# Altium schematic sheet Power.SchDoc: Power
size A3; Project: STM32L073Z-EVAL; Date: Not used; ApprovedBy: Not used; CheckedBy: Not used; Author: Not used; CompanyName: STMicroelectronics; DrawnBy: Not used; Engineer: Not used; Organization: Not used; Address1: Not used; Address2: Not used; Address3: Not used; Address4: Not used; DocumentNumber: 4; Revision: Not used; SheetNumber: 5; SheetTotal: 13; CurrentTime: Not used; CurrentDate: Not used; Time: Not used; DocumentFullPathAndName: Not used; DocumentName: Not used; ModifiedDate: Not used; ImagePath: Not used; ProjectName: Not used; Application_BuildNumber: Not used
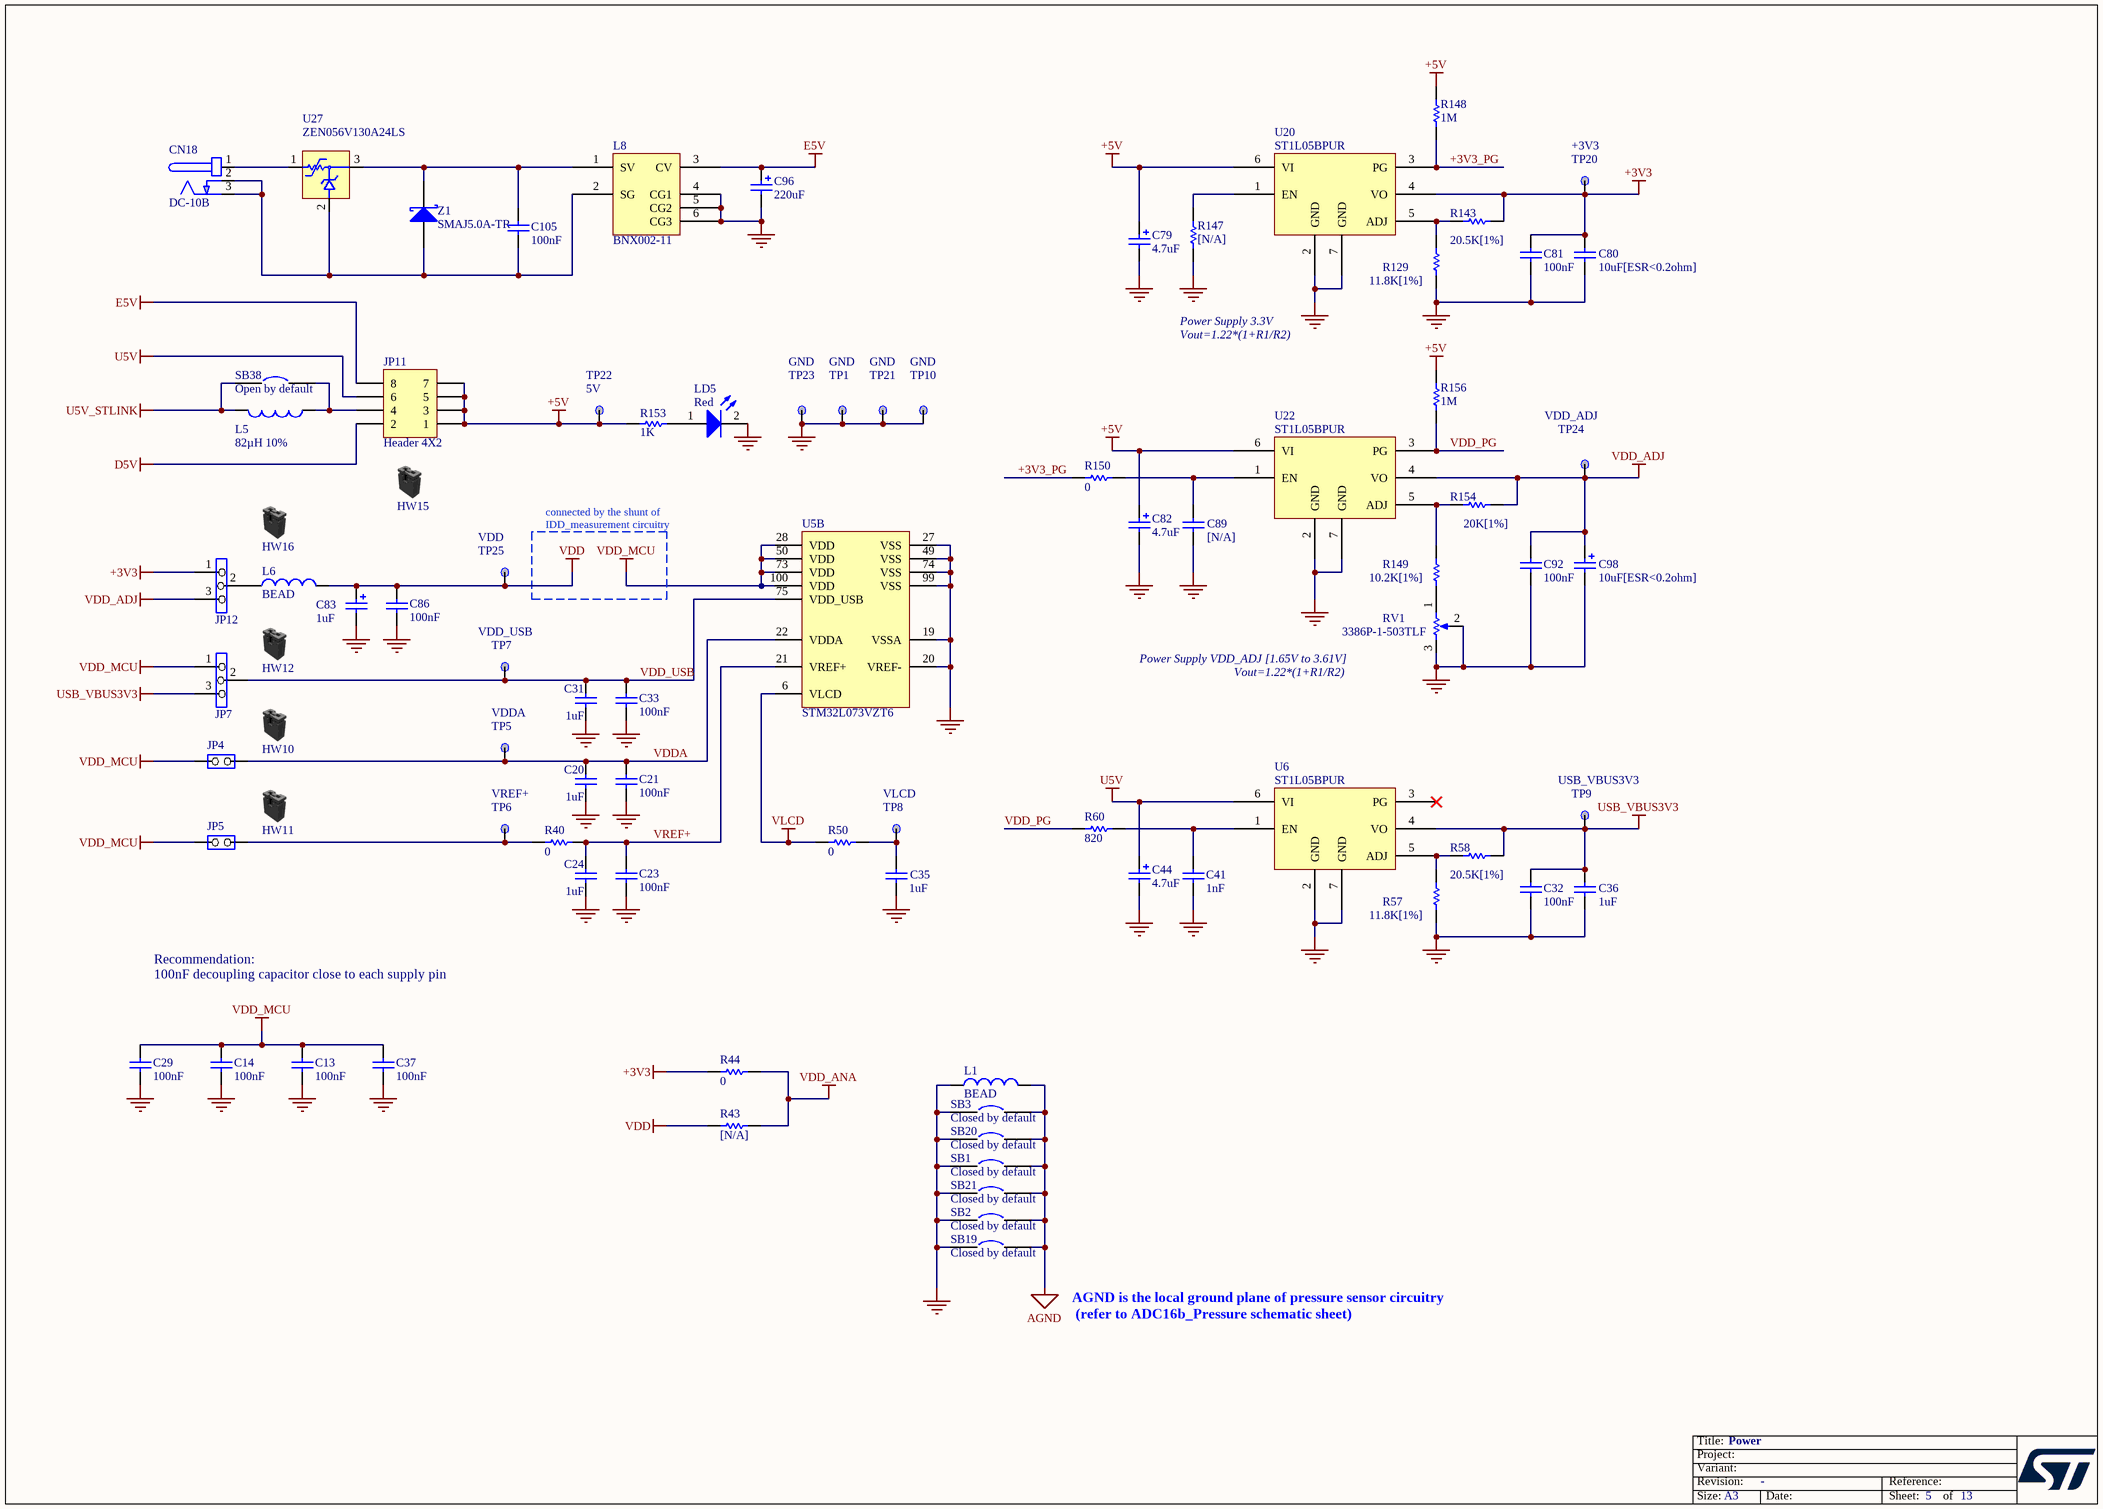
[diagram p0: Power.SchDoc]

## Parts
C13  100nF  [0402C]
C14  100nF  [0402C]
C20  1uF  [0603C]
C21  100nF  [0402C]
C23  100nF  [0402C]
C24  1uF  [0603C]
C29  100nF  [0402C]
C31  1uF  [0603C]
C32  100nF  [0402C]
C33  100nF  [0402C]
C35  1uF  [0603C]
C36  1uF  [0603C]
C37  100nF  [0402C]
C41  1nF  [0603C]
C44  4.7uF  [TAN-A]
C79  4.7uF  [TAN-A]
C80  10uF[ESR<0.2ohm]  [0805C]
C81  100nF  [0402C]
C82  4.7uF  [TAN-A]
C83  1uF  [TAN-A]
C86  100nF  [0402C]
C89  [N/A]  [0603C]
C92  100nF  [0402C]
C96  220uF  [c310m-6]
C98  10uF[ESR<0.2ohm]  [0805C]
C105  100nF  [0402C]
CN18  DC-10B  [PWR_JACK_DC10]
HW10  Shunt Black 2.54mm  (value not drawn)  (mechanical)
HW11  Shunt Black 2.54mm  (value not drawn)  (mechanical)
HW12  Shunt Black 2.54mm  (value not drawn)  (mechanical)
HW15  Shunt Black 2.54mm  (value not drawn)  (mechanical)
HW16  Shunt Black 2.54mm  (value not drawn)  (mechanical)
JP4  (no value)  [SIP2]
JP5  (no value)  [SIP2]
JP7  (no value)  [SIP3]
JP11  Header 4X2  [HDR_2X4_2R54]
JP12  (no value)  [SIP3]
L1  BEAD  [0603L]
L5  82µH 10%  [LSM2_4R9X4R9_H4R1]
L6  BEAD  [0603L]
L8  BNX002-11  [BNX001]
LD5  Red  [0603D]
R40  0  [0603R]
R43  [N/A]  [0603R]
R44  0  [0603R]
R50  0  [0603R]
R57  11.8K[1%]  [0603R]
R58  20.5K[1%]  [0603R]
R60  820  [0603R]
R129  11.8K[1%]  [0603R]
R143  20.5K[1%]  [0603R]
R147  [N/A]  [0603R]
R148  1M  [0603R]
R149  10.2K[1%]  [0603R]
R150  0  [0603R]
R153  1K  [0402R]
R154  20K[1%]  [0603R]
R156  1M  [0603R]
RV1  3386P-1-503TLF  [3386P]
SB1  Closed by default  [SB_0603]
SB2  Closed by default  [SB_0603]
SB3  Closed by default  [SB_0603]
SB19  Closed by default  [SB_0603]
SB20  Closed by default  [SB_0603]
SB21  Closed by default  [SB_0603]
SB38  Open by default  [SB_0603]
TP1  Silkscreen: GND  [TP]  (hidden comment: TP)
TP5  Silkscreen: VDDA  [TP]  (hidden comment: TP)
TP6  Silkscreen: VREF+  [TP]  (hidden comment: TP)
TP7  Silkscreen: VDD_USB  [TP]  (hidden comment: TP)
TP8  Silkscreen: VLCD  [TP]  (hidden comment: TP)
TP9  Silkscreen: USB_VBUS3V3  [TP]  (hidden comment: TP)
TP10  Silkscreen: GND  [TP]  (hidden comment: TP)
TP20  Silkscreen: +3V3  [TP]  (hidden comment: TP)
TP21  Silkscreen: GND  [TP]  (hidden comment: TP)
TP22  Silkscreen: 5V  [TP]  (hidden comment: TP)
TP23  Silkscreen: GND  [TP]  (hidden comment: TP)
TP24  Silkscreen: VDD_ADJ  [TP]  (hidden comment: TP)
TP25  Silkscreen: VDD  [TP]  (hidden comment: TP)
U5  STM32L073VZT6  [IC149_100_025_B5]  (part B of 2)
U6  ST1L05BPUR  [DFN6_0R95_3X3]
U20  ST1L05BPUR  [DFN6_0R95_3X3]
U22  ST1L05BPUR  [DFN6_0R95_3X3]
U27  ZEN056V130A24LS  [TYCO_ZEN056V130A24LS]
Z1  SMAJ5.0A-TR  [sma]

## Nets
+3V3: C80.1 C81.1 JP12.1 R44.1 R143.1 TP20.1 U20.4(VO)
+5V: C79.1 C82.1 JP11.1 JP11.3 JP11.5 JP11.7 R148.1 R153.2 R156.1 TP22.1 U20.6(VI) U22.6(VI)
AGND: L1.2 SB1.2 SB2.2 SB3.2 SB19.2 SB20.2 SB21.2
D5V: JP11.2
E5V: C96.1 JP11.8 L8.3(CV)
GND: C13.1 C14.1 C20.2 C21.1 C23.1 C24.2 C29.1 C31.2 C32.2 C33.1 C35.1 C36.2 C37.1 C41.2 C44.2 C79.2 C80.2 C81.2 C82.2 C83.2 C86.1 C89.1 C92.2 C96.2 C98.2 L1.1 L8.4(CG1) L8.5(CG2) L8.6(CG3) LD5.2(K) R57.2 R129.2 R147.2 RV1.2(TAP) RV1.3(TOP) SB1.1 SB2.1 SB3.1 SB19.1 SB20.1 SB21.1 TP1.1 TP10.1 TP21.1 TP23.1 U5.19(VSSA) U5.20(VREF-) U5.27(VSS) U5.49(VSS) U5.74(VSS) U5.99(VSS) U6.2(GND) U6.7(GND) U20.2(GND) U20.7(GND) U22.2(GND) U22.7(GND)
U5V: C44.1 JP11.6 U6.6(VI)
U5V_STLINK: L5.2 SB38.1
USB_VBUS3V3: C32.1 C36.1 JP7.3 R58.1 TP9.1 U6.4(VO)
VDD: C83.1 C86.2 L6.2 R43.1 TP25.1
VDD_ADJ: C92.1 C98.1 JP12.3 R154.1 TP24.1 U22.4(VO)
VDD_ANA: R43.2 R44.2
VDD_MCU: C13.2 C14.2 C29.2 C37.2 JP4.1(COMMON) JP5.1(COMMON) JP7.1 U5.28(VDD) U5.50(VDD) U5.73(VDD) U5.100(VDD)
VLCD: R50.1 U5.6(VLCD)
+3V3_PG: R148.2 R150.1 U20.3(PG)
VDD_PG: R60.1 R156.2 U22.3(PG)
VDD_USB: C31.1 C33.2 JP7.2 TP7.1 U5.75(VDD_USB)
VDDA: C20.1 C21.2 JP4.2(NO) TP5.1 U5.22(VDDA)
VREF+: C23.2 C24.1 R40.2 U5.21(VREF+)
NetC35_2: C35.2 R50.2 TP8.1
NetC41_1: C41.1 R60.2 U6.1(EN)
NetC89_2: C89.2 R150.2 U22.1(EN)
NetC105_1: C105.1 L8.1(SV) U27.3 Z1.2(K)
NetC105_2: C105.2 CN18.2(GND) CN18.3(GND) L8.2(SG) U27.2 Z1.1(A)
NetCN18_1: CN18.1(+) U27.1
NetJP5_2: JP5.2(NO) R40.1 TP6.1
NetJP11_4: JP11.4 L5.1 SB38.2
NetJP12_2: JP12.2 L6.1
NetLD5_1: LD5.1(A) R153.1
NetR57_1: R57.1 R58.2 U6.5(ADJ)
NetR129_1: R129.1 R143.2 U20.5(ADJ)
NetR147_1: R147.1 U20.1(EN)
NetR149_1: R149.1 R154.2 U22.5(ADJ)
NetR149_2: R149.2 RV1.1(BOT)

Not connected (* = marked no-connect by the designer): U6 3(PG)*

## Notes on the sheet
- Power Supply 3.3V
- Vout=1.22*(1+R1/R2)
- (near TP25) connected by the shunt of
  IDD_measurement circuitry
- Power Supply VDD_ADJ [1.65V to 3.61V]
- Recommendation:
  100nF decoupling capacitor close to each supply pin
- AGND is the local ground plane of pressure sensor circuitry
  (refer to ADC16b_Pressure schematic sheet)
- Title:
- Project:
- Size:
- Revision:
- Variant:
- A3
- -
- Date:
- Reference:
- Sheet:
- of

## Library data of the parts
C13 C14 C29 C37 = CAP: Capacitor; Ordered by: Subcon; Published: 8-Jun-2000; Revision: July-2002: Re-released for DXP Platform.; Publisher: Altium Limited; Value: 100nF; ECCN_US/EU: n/a
C20 C24 C31 C35 = CAP: Capacitor; Value: 100nF; Ordered by: Subcon; Published: 8-Jun-2000; Revision: July-2002: Re-released for DXP Platform.; Publisher: Altium Limited; ECCN_US/EU: n/a
C21 C23 C32 C33 C36 C41 C81 C86 C92 = Cap: Capacitor; Value: 10nF; Ordered by: Subcon; Published: 8-Jun-2000; Revision: July-2002: Re-released for DXP Platform.; Publisher: Altium Limited; ECCN_US/EU: n/a
C44 = Cap Pol1: Polarized Capacitor (Radial); Value: 100pF; Ordered by: Subcon; Published: 8-Jun-2000; Revision: July-2002: Re-released for DXP Platform.; Publisher: Altium Limited; ECCN_US/EU: n/a
C79 C82 C96 = Cap Pol1: Polarized Capacitor (Radial); Ordered by: Subcon; Published: 8-Jun-2000; Revision: July-2002: Re-released for DXP Platform.; Publisher: Altium Limited; ECCN_US/EU: n/a
  C79 C82: Value: 4.7uF
  C96: Value: 220uF
C80 = Cap: Capacitor; Value: 10uF; Ordered by: Subcon; Published: 8-Jun-2000; Revision: July-2002: Re-released for DXP Platform.; Publisher: Altium Limited; ECCN_US/EU: n/a
C83 = Cap Pol1: Polarized Capacitor; Ordered by: Subcon; Published: 8-Jun-2000; Revision: July-2002: Re-released for DXP Platform.; Publisher: Altium Limited; Value: 1uF; ECCN_US/EU: n/a
C89 = cap: Capacitor; Value: 100pF; Ordered by: Subcon; Fitted: NO; Published: 8-Jun-2000; Revision: July-2002: Re-released for DXP Platform.; Publisher: Altium Limited; ECCN_US/EU: n/a
C98 = Cap Pol1: Polarized Capacitor (Radial); Value: 10uF; Ordered by: Subcon; Published: 8-Jun-2000; Revision: July-2002: Re-released for DXP Platform.; Publisher: Altium Limited; ECCN_US/EU: n/a
C105 = CAP: Capacitor; Value: 100pF; Ordered by: Subcon; Published: 8-Jun-2000; Revision: July-2002: Re-released for DXP Platform.; Publisher: Altium Limited; ECCN_US/EU: n/a
CN18 = PJ202A: Manuf_1: wealthmetal; Manuf_Part_1: DC-005-2.5; Ordered by: Subcon; Comments: power jack; Silkscreen: PSU_E5V; ECCN_US/EU: n/a
JP4 = JP2: Ordered by: Subcon; Silkscreen: VDDA; Assembly: closed; ECCN_US/EU: n/a
JP5 = JP2: Ordered by: Subcon; Silkscreen: VREF+; Assembly: closed; ECCN_US/EU: n/a
JP7 = Jumper3: Ordered by: Subcon; Silkscreen: 1,2: VDD_MCU / 2,3: VBUS; Assembly: 1-2 closed (MCU); ECCN_US/EU: n/a
JP11 = Header 4X2: Header, 4-Pin, Dual row; Ordered by: Subcon; Silkscreen: 7,8: E5V /5,6: U5V / 3,4: STlk / 1,2: D5V; Assembly: 7-8 (E5V); Revision: 17-Jul-2002: Re-released for DXP Platform.; Publisher: Altium Limited; ECCN_US/EU: n/a
JP12 = Jumper3: Ordered by: Subcon; Silkscreen: 1,2: +3V3 / 2,3: VDD_ADJ; Assembly: 1-2 (+3V3); ECCN_US/EU: n/a
L1 L6 = Inductor: Bead,600R,350mA,0603; Manuf_1: Tai-tech; Manuf_Part_1: FCM1608KF-601T05; Manuf_2: Wurth Elektronik; Manuf_Part_2: 742863160; Value: 100uH; Ordered by: Subcon; Published: 8-Jun-2000; Revision: July-2002: Re-released for DXP Platform.; Publisher: Altium Limited; ECCN_US/EU: n/a
L5 = Ind_82µH_0.65A_10%: Power Inductor 82µH 0,65A; Manuf_Part_1: PSI054T-820MS-11; Manuf_1: CYNTEC; Manuf_Part_2: A916CY-820M; Manuf_2: TOKO; Order_2: 752-1406; Ordered by: Subcon; Distrib: Jiubaba; Distrib_2: FARNELL; ECCN_US/EU: n/a
L8 = BNX002: Manuf_1: MURATA; Ordered by: Subcon; ECCN_US/EU: n/a; Manuf_Part_1: BNX002-11
LD5 = LED2: Typical RED, GREEN, YELLOW, AMBER GaAs LED; Ordered by: Subcon; Silkscreen: +5V; Published: 8-Jun-2000; Revision: July-2002: Re-released for DXP Platform.; Publisher: Altium Limited; ECCN_US/EU: n/a
R40 R44 R50 R57 R58 R129 R143 R149 R154 = Res1: Resistor; Value: 1K; Ordered by: Subcon; Published: 8-Jun-2000; Revision: July-2002: Re-released for DXP Platform.; Publisher: Altium Limited; ECCN_US/EU: n/a
R43 R147 = res1: Resistor; Value: 1K; Ordered by: Subcon; Fitted: NO; Published: 8-Jun-2000; Revision: July-2002: Re-released for DXP Platform.; Publisher: Altium Limited; ECCN_US/EU: n/a
R60 R148 R150 R156 = res1: Resistor; Value: 1K; Ordered by: Subcon; Published: 8-Jun-2000; Revision: July-2002: Re-released for DXP Platform.; Publisher: Altium Limited; ECCN_US/EU: n/a
R153 = res1: Resistor; Ordered by: Subcon; Published: 8-Jun-2000; Revision: July-2002: Re-released for DXP Platform.; Publisher: Altium Limited; Value: 1K; ECCN_US/EU: n/a
RV1 = RV: Potentiometer 50K; Ordered by: Subcon; Comments: 50K potentiometer; Silkscreen: VDD_ADJ; ECCN_US/EU: n/a
SB1-SB3 SB19-SB21 = Circuit Breaker: Ordered by: Subcon; Comments: Solder bridge; Published: 24-Mar-1999; Revision: July-2002: Re-released for DXP Platform.; Publisher: Altium Limited; ECCN_US/EU: n/a
SB38 = Circuit Breaker: Ordered by: Subcon; Comments: Solder bridge; Fitted: NO; Published: 24-Mar-1999; Revision: July-2002: Re-released for DXP Platform.; Publisher: Altium Limited; ECCN_US/EU: n/a
TP1 TP5-TP10 TP20-TP25 = TP: Ordered by: Subcon; Fitted: NO; ECCN_US/EU: n/a
U5 = BigNemo: Manuf_Part_1: FG=32L073VZT6$x3 cut 2.0 marking "B"; Ordered by: ST; ECCN_US/EU: 3A991A2/NEC; Ref St: 9175165; Manuf_1: ST
U6 U20 U22 = ST1L05: Ordered by: ST; ECCN_US/EU: EAR99/NEC; Ref St: 9176239; Manuf_1: ST; Manuf_Part_1: ST1L05BPUR
U27 = ZEN056V130A24LS: Ordered by: Subcon; ECCN_US/EU: EAR99/NEC
Z1 = D Schottky: Schottky Diode; Code - JEDEC: DO-214-AA; Ordered by: Subcon; ECCN_US/EU: EAR99/NEC; Published: 8-Jun-2000; Revision: July-2002: Re-released for DXP Platform.; Publisher: Altium Limited